# Altium schematic sheet SRAM_Module.SCHDOC
size B; SheetNumber: 2; SheetTotal: 7
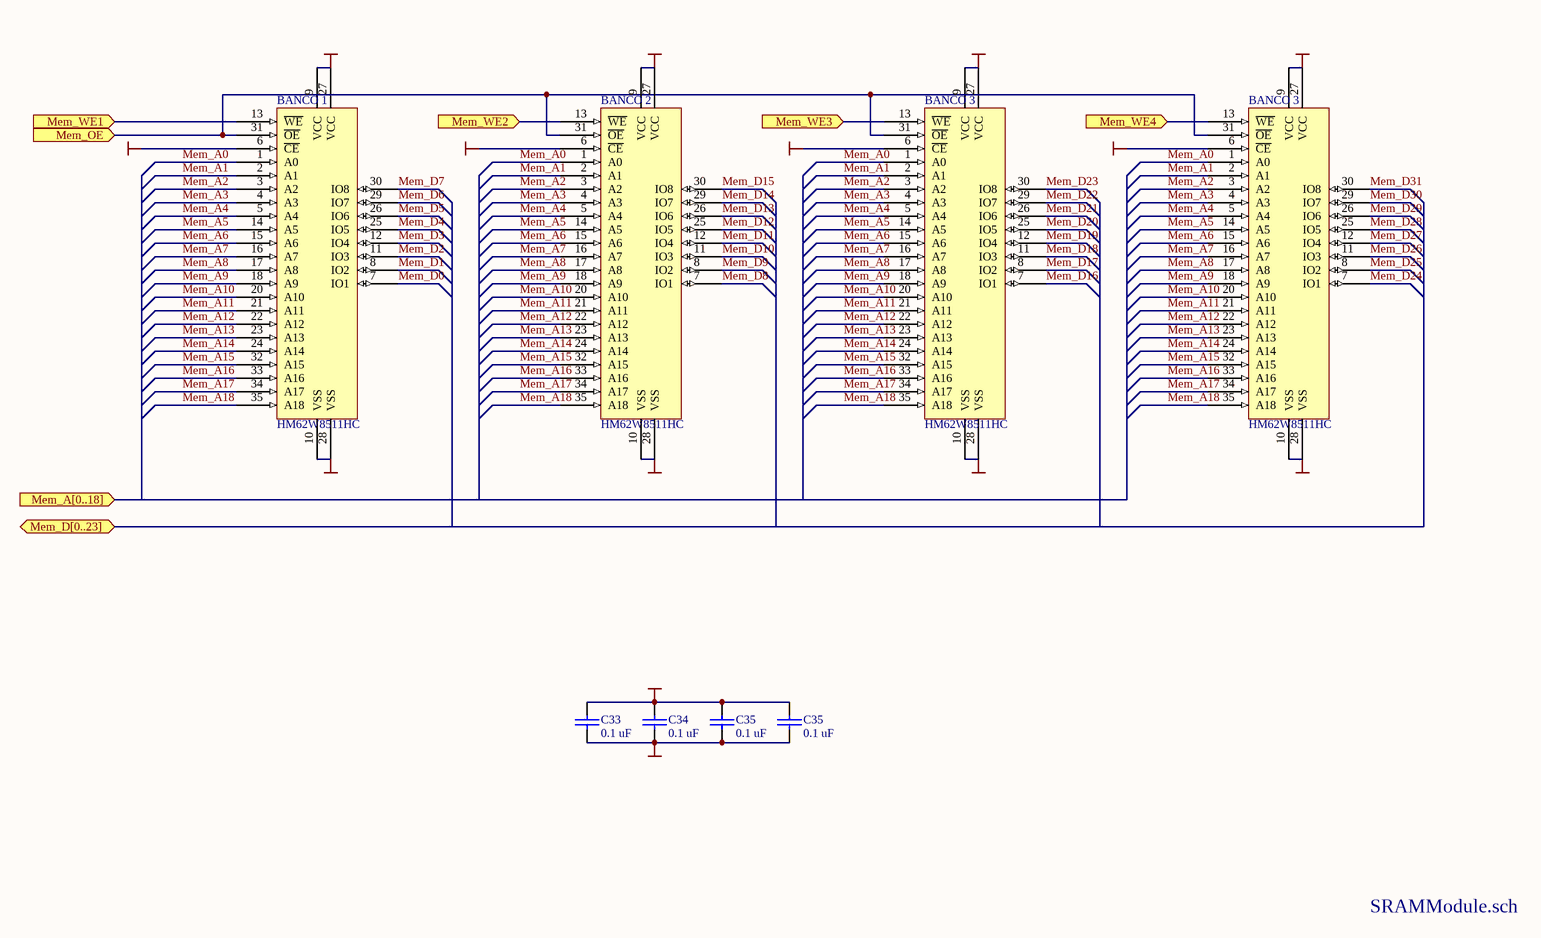
[diagram p0: SRAM_Module.SCHDOC]

## Parts
(Parts that share a designator on the sheet are numbered #1, #2 ... from top to bottom, then left to right.)
BANCO_1  HM62W8511HC  [SOJ36/400]
BANCO_2  HM62W8511HC  [SOJ36/400]
BANCO_3#1  HM62W8511HC  [SOJ36/400]
BANCO_3#2  HM62W8511HC  [SOJ36/400]
C33  0.1 uF  [CAP 10]
C34  0.1 uF  [CAP 10]
C35#1  0.1 uF  [CAP 10]
C35#2  0.1 uF  [CAP 10]

## Ports
Mem_A[0..18] (in), Mem_D[0..23] (bidir), Mem_OE (in), Mem_WE1 (in), Mem_WE2 (in), Mem_WE3 (in), Mem_WE4 (in)

## Nets
GND: BANCO_1.6(~{CE}) BANCO_1.10(VSS) BANCO_1.28(VSS) BANCO_2.6(~{CE}) BANCO_2.10(VSS) BANCO_2.28(VSS) BANCO_3#1.6(~{CE}) BANCO_3#1.10(VSS) BANCO_3#1.28(VSS) BANCO_3#2.6(~{CE}) BANCO_3#2.10(VSS) BANCO_3#2.28(VSS) C33.2 C34.2 C35#1.2 C35#2.2  [also labelled VSS]
VCC: BANCO_1.9(VCC) BANCO_1.27(VCC) BANCO_2.9(VCC) BANCO_2.27(VCC) BANCO_3#1.9(VCC) BANCO_3#1.27(VCC) BANCO_3#2.9(VCC) BANCO_3#2.27(VCC) C33.1 C34.1 C35#1.1 C35#2.1  [also labelled VCC_3.3V]
Mem_A0: BANCO_1.1(A0) BANCO_2.1(A0) BANCO_3#1.1(A0) BANCO_3#2.1(A0)
Mem_A1: BANCO_1.2(A1) BANCO_2.2(A1) BANCO_3#1.2(A1) BANCO_3#2.2(A1)
Mem_A2: BANCO_1.3(A2) BANCO_2.3(A2) BANCO_3#1.3(A2) BANCO_3#2.3(A2)
Mem_A3: BANCO_1.4(A3) BANCO_2.4(A3) BANCO_3#1.4(A3) BANCO_3#2.4(A3)
Mem_A4: BANCO_1.5(A4) BANCO_2.5(A4) BANCO_3#1.5(A4) BANCO_3#2.5(A4)
Mem_A5: BANCO_1.14(A5) BANCO_2.14(A5) BANCO_3#1.14(A5) BANCO_3#2.14(A5)
Mem_A6: BANCO_1.15(A6) BANCO_2.15(A6) BANCO_3#1.15(A6) BANCO_3#2.15(A6)
Mem_A7: BANCO_1.16(A7) BANCO_2.16(A7) BANCO_3#1.16(A7) BANCO_3#2.16(A7)
Mem_A8: BANCO_1.17(A8) BANCO_2.17(A8) BANCO_3#1.17(A8) BANCO_3#2.17(A8)
Mem_A9: BANCO_1.18(A9) BANCO_2.18(A9) BANCO_3#1.18(A9) BANCO_3#2.18(A9)
Mem_A10: BANCO_1.20(A10) BANCO_2.20(A10) BANCO_3#1.20(A10) BANCO_3#2.20(A10)
Mem_A11: BANCO_1.21(A11) BANCO_2.21(A11) BANCO_3#1.21(A11) BANCO_3#2.21(A11)
Mem_A12: BANCO_1.22(A12) BANCO_2.22(A12) BANCO_3#1.22(A12) BANCO_3#2.22(A12)
Mem_A13: BANCO_1.23(A13) BANCO_2.23(A13) BANCO_3#1.23(A13) BANCO_3#2.23(A13)
Mem_A14: BANCO_1.24(A14) BANCO_2.24(A14) BANCO_3#1.24(A14) BANCO_3#2.24(A14)
Mem_A15: BANCO_1.32(A15) BANCO_2.32(A15) BANCO_3#1.32(A15) BANCO_3#2.32(A15)
Mem_A16: BANCO_1.33(A16) BANCO_2.33(A16) BANCO_3#1.33(A16) BANCO_3#2.33(A16)
Mem_A17: BANCO_1.34(A17) BANCO_2.34(A17) BANCO_3#1.34(A17) BANCO_3#2.34(A17)
Mem_A18: BANCO_1.35(A18) BANCO_2.35(A18) BANCO_3#1.35(A18) BANCO_3#2.35(A18)
Mem_D0: BANCO_1.7(IO1)
Mem_D1: BANCO_1.8(IO2)
Mem_D2: BANCO_1.11(IO3)
Mem_D3: BANCO_1.12(IO4)
Mem_D4: BANCO_1.25(IO5)
Mem_D5: BANCO_1.26(IO6)
Mem_D6: BANCO_1.29(IO7)
Mem_D7: BANCO_1.30(IO8)
Mem_D8: BANCO_2.7(IO1)
Mem_D9: BANCO_2.8(IO2)
Mem_D10: BANCO_2.11(IO3)
Mem_D11: BANCO_2.12(IO4)
Mem_D12: BANCO_2.25(IO5)
Mem_D13: BANCO_2.26(IO6)
Mem_D14: BANCO_2.29(IO7)
Mem_D15: BANCO_2.30(IO8)
Mem_D16: BANCO_3#1.7(IO1)
Mem_D17: BANCO_3#1.8(IO2)
Mem_D18: BANCO_3#1.11(IO3)
Mem_D19: BANCO_3#1.12(IO4)
Mem_D20: BANCO_3#1.25(IO5)
Mem_D21: BANCO_3#1.26(IO6)
Mem_D22: BANCO_3#1.29(IO7)
Mem_D23: BANCO_3#1.30(IO8)
Mem_D24: BANCO_3#2.7(IO1)
Mem_D25: BANCO_3#2.8(IO2)
Mem_D26: BANCO_3#2.11(IO3)
Mem_D27: BANCO_3#2.12(IO4)
Mem_D28: BANCO_3#2.25(IO5)
Mem_D29: BANCO_3#2.26(IO6)
Mem_D30: BANCO_3#2.29(IO7)
Mem_D31: BANCO_3#2.30(IO8)
Mem_OE: BANCO_1.31(~{OE}) BANCO_2.31(~{OE}) BANCO_3#1.31(~{OE}) BANCO_3#2.31(~{OE}) ; port Mem_OE
Mem_WE1: BANCO_1.13(~{WE}) ; port Mem_WE1
Mem_WE2: BANCO_2.13(~{WE}) ; port Mem_WE2
Mem_WE3: BANCO_3#1.13(~{WE}) ; port Mem_WE3
Mem_WE4: BANCO_3#2.13(~{WE}) ; port Mem_WE4

## Notes on the sheet
- SRAMModule.sch

## Library data of the parts
C33 C34 C35#1 C35#2 = CAP: Capacitor